# Altium schematic sheet Sheet1.SchDoc
size A4
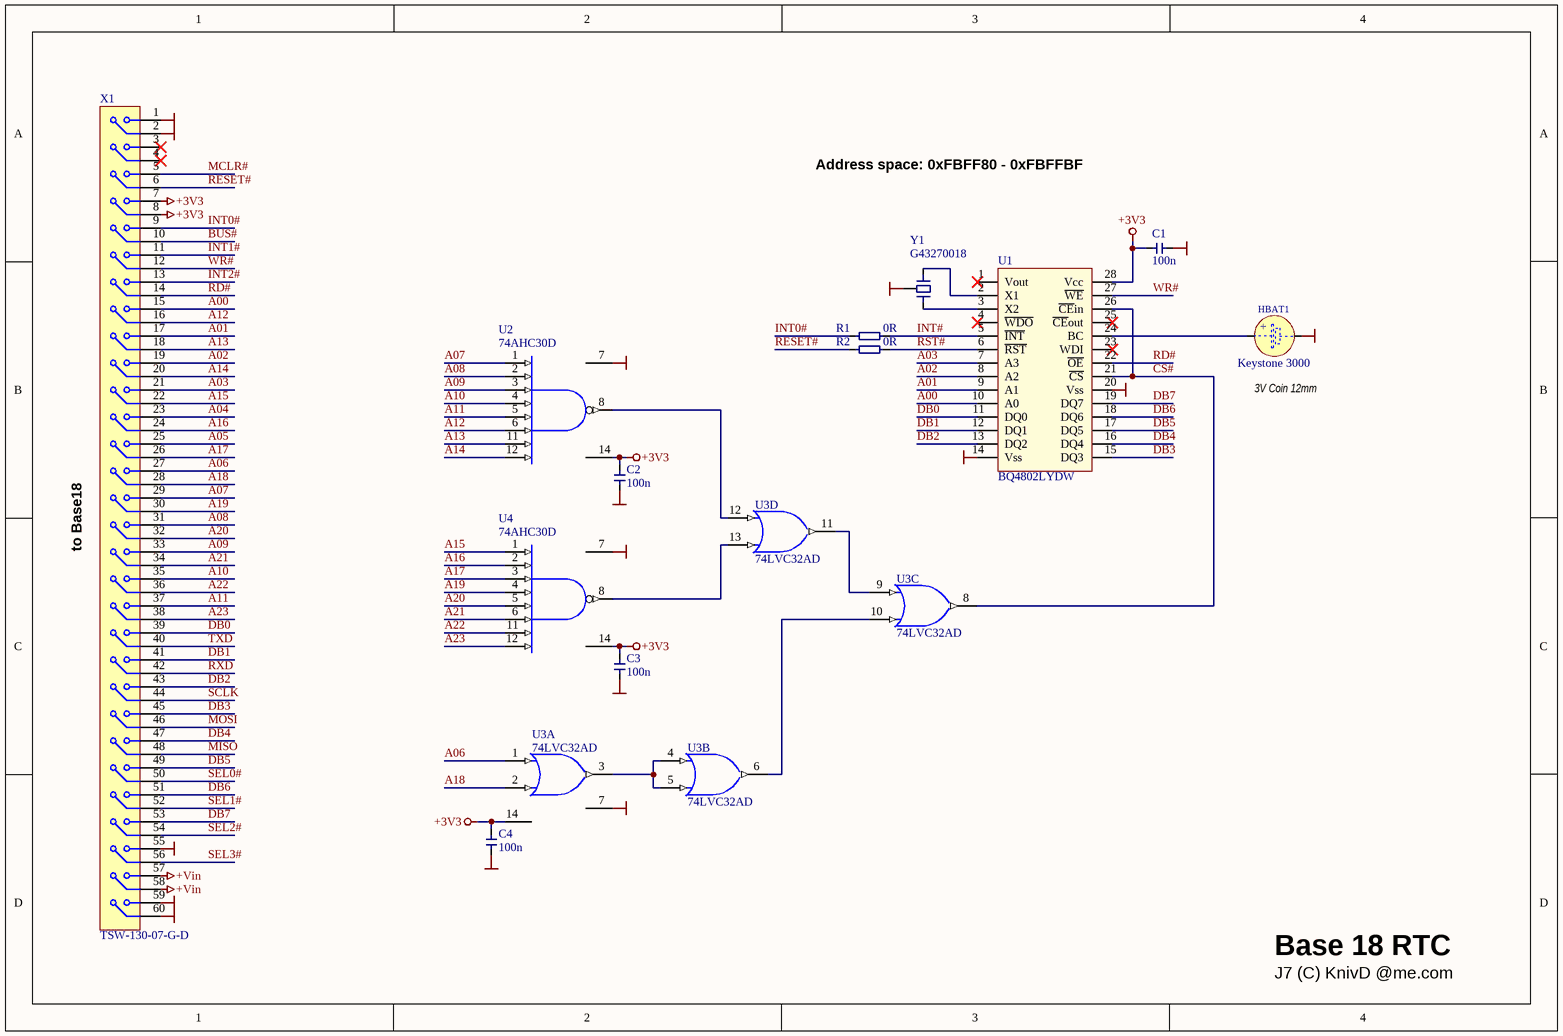
[diagram p0: Sheet1.SchDoc]

## Parts
C1  100n  [CAPC3216X110N]
C2  100n  [CAPC3216X110N]
C3  100n  [CAPC3216X110N]
C4  100n  [CAPC3216X110N]
HBAT1  Keystone 3000  [BATH_KEYSTONE_3000]
R1  0R  [RESC3216X75N]
R2  0R  [RESC3216X75N]
U1  BQ4802LYDW  [SOIC127P1032X265-28N]
U2  74AHC30D  [SOIC14]
U3  74LVC32AD  [SOIC14]  (parts A,B,C,D of 4)
U4  74AHC30D  [SOIC14]
X1  TSW-130-07-G-D  [DIL60-M-EDGE]
Y1  G43270018  [Crystal 79X37 (4)]

## Nets
+3V3: C1.1 C2.2 C3.2 C4.2 U1.28(Vcc) U2.14(VCC) U3.14(VCC) U4.14(VCC) X1.7 X1.8  [also labelled VCC]
+Vin: X1.57 X1.58
GND: C1.2 C2.1 C3.1 C4.1 HBAT1.2(MINUS) U1.14(Vss) U1.20(Vss) U2.7(GND) U3.7(GND) U4.7(GND) X1.1 X1.2 X1.55 X1.59 X1.60 Y1.0(GND)
A00: U1.10(A0) X1.15
A01: U1.9(A1) X1.17
A02: U1.8(A2) X1.19
A03: U1.7(A3) X1.21
A04: X1.23
A05: X1.25
A06: U3.1 X1.27
A07: U2.1 X1.29
A08: U2.2 X1.31
A09: U2.3 X1.33
A10: U2.4 X1.35
A11: U2.5 X1.37
A12: U2.6 X1.16
A13: U2.11 X1.18
A14: U2.12 X1.20
A15: U4.1 X1.22
A16: U4.2 X1.24
A17: U4.3 X1.26
A18: U3.2 X1.28
A19: U4.4 X1.30
A20: U4.5 X1.32
A21: U4.6 X1.34
A22: U4.11 X1.36
A23: U4.12 X1.38
BUS#: X1.10
CS#: U1.21(~{CS}) U1.26(~{CE}in) U3.8(Y)
DB0: U1.11(DQ0) X1.39
DB1: U1.12(DQ1) X1.41
DB2: U1.13(DQ2) X1.43
DB3: U1.15(DQ3) X1.45
DB4: U1.16(DQ4) X1.47
DB5: U1.17(DQ5) X1.49
DB6: U1.18(DQ6) X1.51
DB7: U1.19(DQ7) X1.53
INT0#: R1.1 X1.9
INT1#: X1.11
INT2#: X1.13
INT#: R1.2 U1.5(~{INT})
MCLR#: X1.5
MISO: X1.48
MOSI: X1.46
RD#: U1.22(~{OE}) X1.14
RESET#: R2.1 X1.6
RST#: R2.2 U1.6(~{RST})
RXD: X1.42
SCLK: X1.44
SEL0#: X1.50
SEL1#: X1.52
SEL2#: X1.54
SEL3#: X1.56
TXD: X1.40
WR#: U1.27(~{WE}) X1.12
NetHBAT1_1: HBAT1.1(PLUS) U1.24(BC)
NetU1_2: U1.2(X1) Y1.1
NetU1_3: U1.3(X2) Y1.2
NetU2_8: U2.8 U3.12(A)
NetU3_3: U3.3 U3.4(A) U3.5(B)
NetU3_6: U3.6(Y) U3.10(B)
NetU3_9: U3.9(A) U3.11(Y)
NetU3_13: U3.13(B) U4.8

Not connected (* = marked no-connect by the designer): U1 1(Vout)* 4(~{WDO})* 23(WDI)* 25(~{CE}out)*; X1 3* 4*

## Notes on the sheet
- Address space: 0xFBFF80 - 0xFBFFBF
- (near HBAT1) 3V Coin 12mm
- to Base18
- Base 18 RTC
- J7 (C) KnivD @me.com
- (in symbol BATH_KEYSTONE_3000) +

## Library data of the parts
C1-C4 = Capacitor
HBAT1 = BATH_KEYSTONE_3000: Battery Holder whit 2 Pin; Part Description: SMD Battery Holders for BR1216, CR1216, BR1220, CL1220, CR1220, BR1225 Coin Cells; Manufacturer Part Number: 3000; Table: Batteries; Part Number: BATH_KEYSTONE_3000; Component Kind: Standard; Component Type: Standard; Pin Count: 3; PackageDescription: SMD Battery Holders for BR1216, CR1216, BR1220, CL1220, CR1220, BR1225 Coin Cells; Family: Battery; Mounted: Yes; Socket: No; SMD: No; Manufacturer: KEYSTONE; ComponentHeight: 3.17mm; HelpURL: \\cern.ch\dfs\Applications\Altium\Datasheets\BATH_KEYSTONE_3000.pdf; Author: CERN DEM JLC; CreateDate: 17/04/2012; LatestRevisionDate: 17/04/2012
R1 R2 = Resistor
U1 = BQ4802LY: PARALLEL REAL-TIME CLOCK WITH CPU SUPERVISOR AND  EXTERNAL SRAM NONVOLATILE MEMORY BACKUP; Manufacturer: Texas Instruments
U2 U4 = 74HCT30N: 8-Input NAND Gate; Manufacturer: NXP SEMICONDUCTORS; Table: Standard Logic; Part Number: 74HCT30N; Component Kind: Standard; Component Type: Standard; Device: 74HCT30N; Footprint: DIP14-300; PackageDescription: DIP; 14 Leads; Row Spacing 7.62 mm; Pitch 2.54 mm; Part Description: 8-Input NAND Gate; Manufacturer Part Number: 74HCT30N; Pin Count: 11; Case: DIP14-300; Mounted: Yes; Socket: Yes; SMD: No; ComponentHeight: 4.2mm; Author: CERN DEM JLC; HelpURL: \\cern.ch\dfs\Applications\Altium\Datasheets\74HCT30N.pdf; CreateDate: 11/12/2012; LatestRevisionDate: 11/12/2012
U3 = 74HCT32N: Quad 2-Input OR Gate; Manufacturer: NXP SEMICONDUCTORS; Table: Standard Logic; Part Number: 74HCT32N; Component Kind: Standard; Component Type: Standard; Device: 74HCT32N; Footprint: DIP14-300; PackageDescription: DIP; 14 Leads; Row Spacing 7.62 mm; Pitch 2.54 mm; Part Description: Quad 2-Input OR Gate; Manufacturer Part Number: 74HCT32N; Pin Count: 14; Case: DIP14-300; Mounted: Yes; Socket: Yes; SMD: No; ComponentHeight: 4.2mm; Author: CERN DEM JLC; HelpURL: \\cern.ch\dfs\Applications\Altium\Datasheets\74HCT32N.pdf; CreateDate: 11/12/2012; LatestRevisionDate: 11/12/2012
X1 = Connector 2x30: Dual row, 60-way connector
Y1 = Crystal (ground): Crystal Resonator